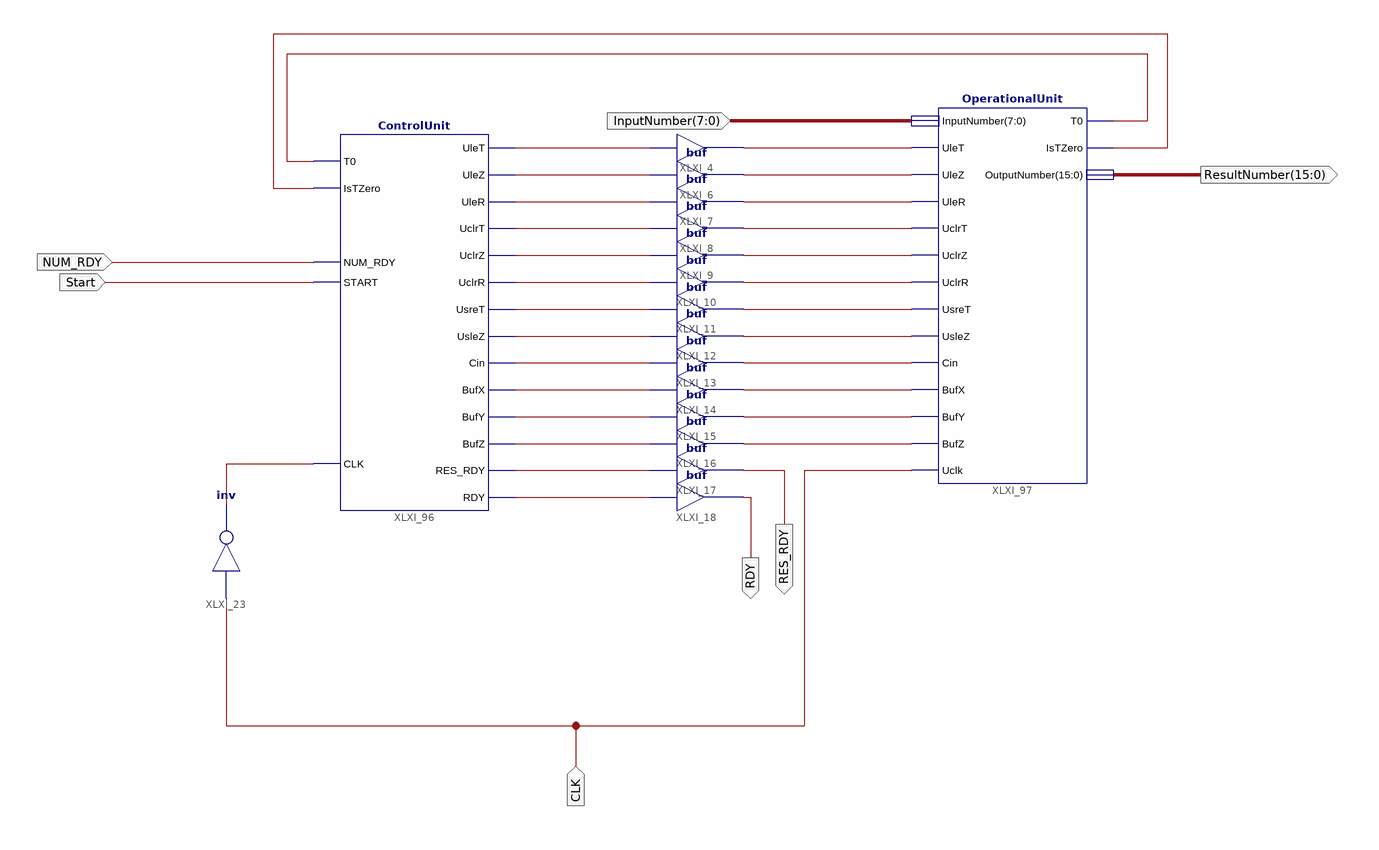
[diagram p0: schematic sheet 1]
// Xilinx ISE schematic Project_System.sch (spartan3a) as structural Verilog: 17 symbols, 7 ports
module Project_System (
  input  [7:0] InputNumber,
  input  CLK,
  input  Start,
  input  NUM_RDY,
  output [15:0] ResultNumber,
  output RDY,
  output RES_RDY
);

  wire XLXN_61, XLXN_62, XLXN_63, XLXN_64, XLXN_65, XLXN_66, XLXN_67, XLXN_68, XLXN_69, XLXN_70, XLXN_71,
       XLXN_72, XLXN_74, XLXN_212, XLXN_213, XLXN_214, XLXN_215, XLXN_217, XLXN_218, XLXN_219, XLXN_220,
       XLXN_221, XLXN_222, XLXN_223, XLXN_224, XLXN_225, XLXN_238, XLXN_239, XLXN_267;

  buf XLXI_7 (XLXN_220, XLXN_63);
  buf XLXI_8 (XLXN_218, XLXN_64);
  buf XLXI_9 (XLXN_219, XLXN_65);
  buf XLXI_10 (XLXN_217, XLXN_66);
  buf XLXI_11 (XLXN_224, XLXN_67);
  buf XLXI_12 (XLXN_223, XLXN_68);
  buf XLXI_13 (XLXN_215, XLXN_69);
  buf XLXI_14 (XLXN_212, XLXN_70);
  buf XLXI_15 (XLXN_213, XLXN_71);
  buf XLXI_16 (XLXN_214, XLXN_72);
  buf XLXI_17 (RES_RDY, XLXN_225);
  buf XLXI_18 (RDY, XLXN_74);
  buf XLXI_4 (XLXN_221, XLXN_61);
  buf XLXI_6 (XLXN_222, XLXN_62);
  ControlUnit XLXI_96 (
    .BufX(XLXN_70), .BufY(XLXN_71), .BufZ(XLXN_72), .Cin(XLXN_69), .RDY(XLXN_74), .RES_RDY(XLXN_225),
    .UclrR(XLXN_66), .UclrT(XLXN_64), .UclrZ(XLXN_65), .UleR(XLXN_63), .UleT(XLXN_61), .UleZ(XLXN_62),
    .UsleZ(XLXN_68), .UsreT(XLXN_67), .T0(XLXN_238), .IsTZero(XLXN_239), .START(Start), .NUM_RDY(NUM_RDY),
    .CLK(XLXN_267));
  OperationalUnit XLXI_97 (
    .BufX(XLXN_212), .BufY(XLXN_213), .BufZ(XLXN_214), .Cin(XLXN_215), .InputNumber(InputNumber),
    .IsTZero(XLXN_239), .OutputNumber(ResultNumber), .T0(XLXN_238), .Uclk(CLK), .UclrR(XLXN_217),
    .UclrT(XLXN_218), .UclrZ(XLXN_219), .UleR(XLXN_220), .UleT(XLXN_221), .UleZ(XLXN_222), .UsleZ(XLXN_223),
    .UsreT(XLXN_224));
  not XLXI_23 (XLXN_267, CLK);
endmodule
